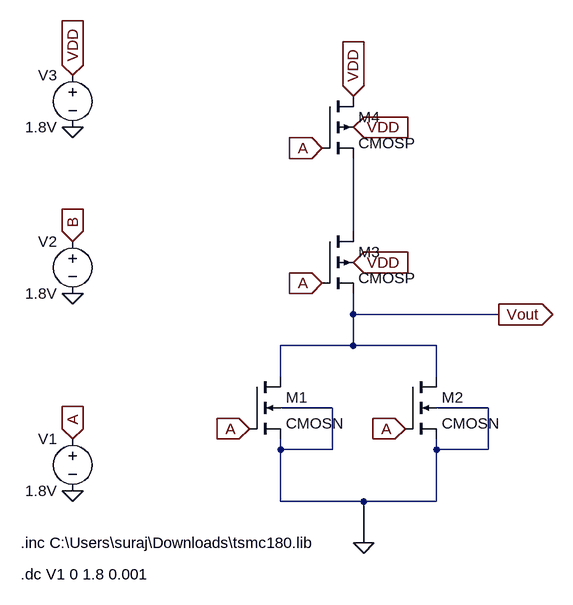
[diagram p0: schematic NOR_180nm.asc]
NOR_180nm.asc, the LTspice schematic file:
Version 4
SHEET 1 880 688
WIRE 144 112 144 0
WIRE 144 240 144 208
WIRE 368 240 144 240
WIRE 144 288 144 240
WIRE 144 288 32 288
WIRE 272 288 144 288
WIRE 32 336 32 288
WIRE 272 336 272 288
WIRE 112 384 32 384
WIRE 352 384 272 384
WIRE 32 448 32 432
WIRE 112 448 112 384
WIRE 112 448 32 448
WIRE 272 448 272 432
WIRE 352 448 352 384
WIRE 352 448 272 448
WIRE 32 528 32 448
WIRE 160 528 32 528
WIRE 272 528 272 448
WIRE 272 528 160 528
WIRE 160 592 160 528
FLAG 160 592 0
FLAG 368 240 Vout
IOPIN 368 240 Out
FLAG -288 -48 0
FLAG -288 208 0
FLAG -288 512 0
FLAG -288 432 A
IOPIN -288 432 In
FLAG -16 416 A
IOPIN -16 416 In
FLAG 96 -16 A
IOPIN 96 -16 In
FLAG -288 128 B
IOPIN -288 128 In
FLAG 224 416 A
IOPIN 224 416 In
FLAG 96 192 A
IOPIN 96 192 In
FLAG -288 -128 VDD
IOPIN -288 -128 In
FLAG 144 -96 VDD
IOPIN 144 -96 In
FLAG 144 160 VDD
IOPIN 144 160 In
FLAG 144 -48 VDD
IOPIN 144 -48 In
SYMBOL nmos4 -16 336 R0
SYMATTR InstName M1
SYMATTR Value CMOSN
SYMATTR Value2 l=0.18u w=5u
SYMBOL nmos4 224 336 R0
SYMATTR InstName M2
SYMATTR Value CMOSN
SYMATTR Value2 l=0.18u w=5u
SYMBOL pmos4 96 112 R0
SYMATTR InstName M3
SYMATTR Value CMOSP
SYMATTR Value2 l=0.18u w=25u
SYMBOL pmos4 96 -96 R0
SYMATTR InstName M4
SYMATTR Value CMOSP
SYMATTR Value2 l=0.18u w=25u
SYMBOL voltage -288 416 M0
WINDOW 123 0 0 Left 0
WINDOW 39 0 0 Left 0
SYMATTR InstName V1
SYMATTR Value 1.8V
SYMBOL voltage -288 112 M0
WINDOW 123 0 0 Left 0
WINDOW 39 0 0 Left 0
SYMATTR InstName V2
SYMATTR Value 1.8V
SYMBOL voltage -288 -144 M0
WINDOW 123 0 0 Left 0
WINDOW 39 0 0 Left 0
SYMATTR InstName V3
SYMATTR Value 1.8V
TEXT -368 592 Left 2 !.inc C:\\Users\\suraj\\Downloads\\tsmc180.lib
TEXT -368 640 Left 2 !.dc V1 0 1.8 0.001

The netlist it stands for:
* NOR_180nm.asc
M1 Vout A 0 0 CMOSN l=0.18u w=5u
M2 Vout A 0 0 CMOSN l=0.18u w=5u
M3 N001 A Vout VDD CMOSP l=0.18u w=25u
M4 VDD A N001 VDD CMOSP l=0.18u w=25u
V1 A 0 1.8V
V2 B 0 1.8V
V3 VDD 0 1.8V
.model NMOS NMOS
.model PMOS PMOS
.lib standard.mos
.inc C:\Users\suraj\Downloads\tsmc180.lib
.dc V1 0 1.8 0.001
.backanno
.end